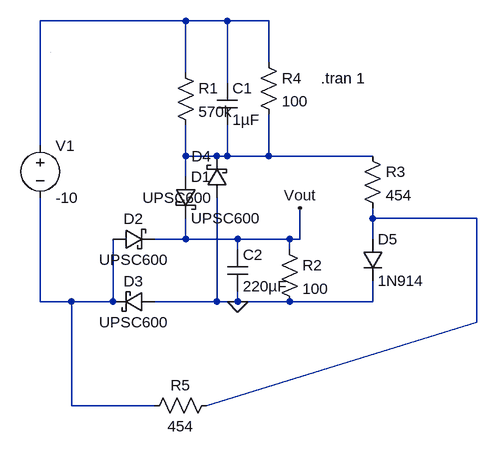
[diagram p0: schematic LEDCampLanternCharger.asc]
LEDCampLanternCharger.asc, the LTspice schematic file:
Version 4
SHEET 1 880 680
WIRE 208 -48 -16 -48
WIRE 272 -48 208 -48
WIRE 336 -48 272 -48
WIRE 336 16 336 -48
WIRE 208 32 208 -48
WIRE 272 48 272 -48
WIRE -16 144 -16 -48
WIRE 208 160 208 112
WIRE 256 160 208 160
WIRE 272 160 272 112
WIRE 272 160 256 160
WIRE 336 160 336 96
WIRE 336 160 272 160
WIRE 496 160 336 160
WIRE 208 192 208 160
WIRE 496 256 496 240
WIRE 656 256 496 256
WIRE 208 288 208 256
WIRE 208 288 160 288
WIRE 288 288 208 288
WIRE 368 288 288 288
WIRE 384 288 384 240
WIRE 384 288 368 288
WIRE 496 288 496 256
WIRE 288 304 288 288
WIRE 368 304 368 288
WIRE -16 384 -16 224
WIRE 32 384 -16 384
WIRE 96 384 96 288
WIRE 96 384 32 384
WIRE 256 384 256 224
WIRE 256 384 160 384
WIRE 288 384 288 368
WIRE 288 384 256 384
WIRE 368 384 288 384
WIRE 496 384 496 352
WIRE 496 384 368 384
WIRE 656 416 656 256
WIRE 32 544 32 384
WIRE 160 544 32 544
WIRE 240 544 656 416
WIRE 0 0 0 0
FLAG 288 384 0
FLAG 384 240 Vout
SYMBOL voltage -16 128 R0
WINDOW 123 0 0 Left 2
WINDOW 39 0 0 Left 2
SYMATTR InstName V1
SYMATTR Value -10
SYMBOL cap 256 48 R0
SYMATTR InstName C1
SYMATTR Value 1µF
SYMBOL res 192 16 R0
SYMATTR InstName R1
SYMATTR Value 570k
SYMBOL schottky 192 192 R0
SYMATTR InstName D1
SYMATTR Value UPSC600
SYMATTR Description Diode
SYMATTR Type diode
SYMBOL cap 272 304 R0
SYMATTR InstName C2
SYMATTR Value 220µF
SYMBOL res 352 288 R0
SYMATTR InstName R2
SYMATTR Value 100
SYMBOL schottky 96 304 R270
WINDOW 0 32 32 VTop 2
WINDOW 3 0 32 VBottom 2
SYMATTR InstName D2
SYMATTR Value UPSC600
SYMATTR Description Diode
SYMATTR Type diode
SYMBOL schottky 160 368 R90
WINDOW 0 0 32 VBottom 2
WINDOW 3 32 32 VTop 2
SYMATTR InstName D3
SYMATTR Value UPSC600
SYMATTR Description Diode
SYMATTR Type diode
SYMBOL schottky 272 224 R180
WINDOW 0 24 64 Left 2
WINDOW 3 24 0 Left 2
SYMATTR InstName D4
SYMATTR Value UPSC600
SYMATTR Description Diode
SYMATTR Type diode
SYMBOL res 480 144 R0
SYMATTR InstName R3
SYMATTR Value 454
SYMBOL diode 480 288 R0
SYMATTR InstName D5
SYMATTR Value 1N914
SYMBOL res 320 0 R0
SYMATTR InstName R4
SYMATTR Value 100
SYMBOL res 256 528 R90
WINDOW 0 0 56 VBottom 2
WINDOW 3 32 56 VTop 2
SYMATTR InstName R5
SYMATTR Value 454
TEXT 416 40 Left 2 !.tran 1

The netlist it stands for:
* LEDCampLanternCharger.asc
V1 N001 N004 -10
C1 N001 N002 1µF
R1 N001 N002 570k
D1 N002 Vout UPSC600
C2 Vout 0 220µF
R2 Vout 0 100
D2 N004 Vout UPSC600
D3 0 N004 UPSC600
D4 0 N002 UPSC600
R3 N002 N003 454
D5 N003 0 1N914
R4 N001 N002 100
R5 N003 N004 454
.model D D
.lib standard.dio
.tran 1
.backanno
.end